# Altium schematic sheet CP2102_USB_UART.SchDoc
size A; SheetNumber: 2; SheetTotal: 7
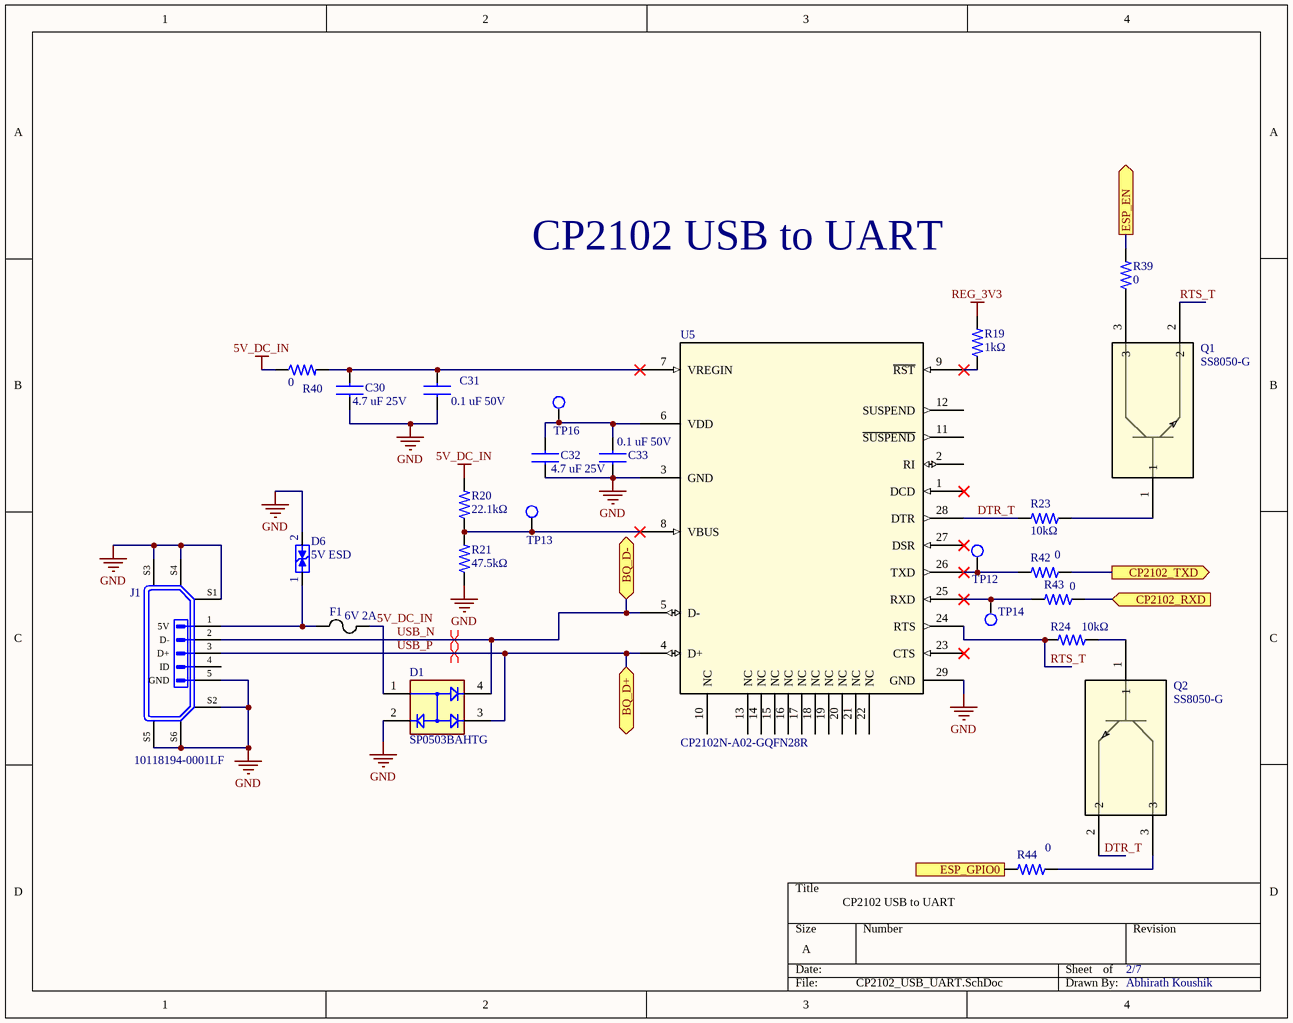
[diagram p0: CP2102_USB_UART.SchDoc]

## Parts
C30  4.7 uF 25V  [CAPC1608X90N]
C31  0.1 uF 50V  [CAPC1608X90N]
C32  4.7 uF 25V  [CAPC1608X90N]
C33  0.1 uF 50V  [CAPC1608X90N]
D1  SP0503BAHTG  [SOT143_New]
D6  5V ESD  [WE-TVS_DFN1610-2L]
F1  6V 2A  [0ZCJ_BEL]
J1  Manufacturer Part Number: 10118194-0001LF  [AMPHENOL_10118194-0001LF]  (hidden comment: micro-USB)
Q1  SS8050-G  [TRAN_SS8050-G_CIP]
Q2  SS8050-G  [TRAN_SS8050-G_CIP]
R19  1kΩ  [RES_0603_1608X06]
R20  22.1kΩ  [RES_0603_1608X06]
R21  47.5kΩ  [RES_0603_1608X06]
R23  10kΩ  [RES_0603_1608X06]
R24  10kΩ  [RES_0603_1608X06]
R39  0  [RES_0603_1608X06]
R40  0  [RES_0603_1608X06]
R42  0  [RES_0603_1608X06]
R43  0  [RES_0603_1608X06]
R44  0  [RES_0603_1608X06]
TP12  Test Point  [Test Point]  (value not drawn)  (net tie, no BOM)
TP13  Test Point  [Test Point]  (value not drawn)  (net tie, no BOM)
TP14  Test Point  [Test Point]  (value not drawn)  (net tie, no BOM)
TP16  Test Point  [Test Point]  (value not drawn)  (net tie, no BOM)
U5  CP2102N-A02-GQFN28R  [IC_CP2102N-A02-GQFN28R]

## Ports
BQ_D+ (bidir, see BQ25798_PMIC[1B]), BQ_D- (bidir, see BQ25798_PMIC[1B]), CP2102_RXD (in, see ESP32_SoC[2B]), CP2102_TXD (out, see ESP32_SoC[2B]), ESP_EN (out, see ESP32_SoC[2A]), ESP_GPIO0 (out, see ESP32_SoC[3A])

## Nets
5V_DC_IN: D1.1 F1.1 R20.2 R40.1
GND: C30.2 C31.2 C32.2 C33.2 D1.2 D6.2(GND) J1.5(GND) J1.S1(GND) J1.S2(GND) J1.S3(GND) J1.S4(GND) J1.S5(GND) J1.S6(GND) R21.1 U5.3(GND) U5.29(GND)
REG_3V3: R19.2
CP2102_RXD: R43.1 ; port CP2102_RXD
CP2102_TXD: R42.1 ; port CP2102_TXD
DTR_T: Q2.2 R23.2 U5.28(DTR)
ESP_EN: R39.2 ; port ESP_EN
ESP_GPIO0: R44.2 ; port ESP_GPIO0
RTS_T: Q1.2 R24.2 U5.24(RTS)
USB_N: D1.4 J1.2(D-) U5.5(D-) ; port BQ_D-
USB_P: D1.3 J1.3(D+) U5.4(D+) ; port BQ_D+
NetC30_1: C30.1 C31.1 R40.2 U5.7(VREGIN)
NetC32_1: C32.1 C33.1 TP16.1 U5.6(VDD)
NetD6_1: D6.1(I/O) F1.2 J1.1(5V)
NetQ1_1: Q1.1 R23.1
NetQ1_3: Q1.3 R39.1
NetQ2_1: Q2.1 R24.1
NetQ2_3: Q2.3 R44.1
NetR19_1: R19.1 U5.9(~{RST})
NetR20_1: R20.1 R21.2 TP13.1 U5.8(VBUS)
NetR42_2: R42.2 TP12.1 U5.26(TXD)
NetR43_2: R43.2 TP14.1 U5.25(RXD)

Not connected (* = marked no-connect by the designer): J1 4(ID); U5 1(DCD)* 2(RI) 10(NC) 11(~{SUSPEND}) 12(SUSPEND) 13(NC) 14(NC) 15(NC) 16(NC) 17(NC) 18(NC) 19(NC) 20(NC) 21(NC) 22(NC) 23(CTS)* 27(DSR)*

## Layout directives
differential pair: USB_N, USB_P

## Notes on the sheet
- CP2102 USB to UART
- 2/7
- Abhirath Koushik

## Library data of the parts
C30 C32 = GRM188R61E475KE11D: Ceramic capacitor SMD 0603 4.7 µF 25 V 10 % (L x W x H) 1.6 x 0.8 x 0.8 mm Murata GRM188R61E475KE11D 4000 pc(s); MF: Murata Electronics; SnapEDA_Link: https://www.snapeda.com/parts/GRM188R61E475KE11D/Murata+Electronics+North+America/view-part/?ref=snap; Package: 1608 Murata; Value: *; MP: GRM188R61E475KE11D; Check_prices: https://www.snapeda.com/parts/GRM188R61E475KE11D/Murata+Electronics+North+America/view-part/?ref=eda
C31 C33 = GCM31C5C1H104FA16L: 0.10uF Tol.1%. Rated voltage 50Vdc 125C SMD capacitor C0G(EIA) with capacitance; MF: Murata; Check_prices: https://www.snapeda.com/parts/GCM31C5C1H104FA16L/Murata/view-part/?ref=eda; Value: *; MP: GCM31C5C1H104FA16L; Purchase-URL: https://pricing.snapeda.com/search/part/GCM31C5C1H104FA16L/?ref=eda; SnapEDA_Link: https://www.snapeda.com/parts/GCM31C5C1H104FA16L/Murata/view-part/?ref=snap; Package: 3216 Murata; Digi-Key_Part_Number: 490-GCM31C5C1H104FA16LTR-ND
D1 = SP0503BAHTG: SP050xBA Series 8.5 V 30 pF Triple Uni-Directional TVS Avalanche Diode-SOT143-4; Manufacturer: Littelfuse; Breakdown Voltage: 5.5V; Value: 30pF; Clamping Voltage: 6.8V; Direction: Unidirectional; Element Configuration: Common Anode; ESD Protection: Yes; Leakage Current: 100nA; Max Power Dissipation: 225mW; Number of Channels: 3; Power Line Protection: No; Voltage Rating (DC): 5V; Supplier: DigiKey; Supplier Part Number: F2715CT-ND; Manufacturer Part Number: SP0503BAHTG; RoHS: Compliant; Category: TVS Diodes; Stock: 99308; Pricing: 1=0.6, 10=0.5, 100=0.424, 500=0.373, 1000=0.343 (USD); Case/Package: SOT-143; China RoHS: Compliant; Composition: Zener; Depth: 1.4mm; Diode Type: Avalanche; Height: 1.22mm; Lead Free: Lead Free; Length: 3.04mm; Lifecycle Status: Production; Max Operating Temperature: 125°C; Max Reverse Leakage Current: 100nA; Min Operating Temperature: -40°C; Mounting Technology: Surface Mount; Number of Elements: 3; Pins: 4; Number of Terminals: 4; Number of Unidirectional Channels: 3; Operating Supply Voltage: 5.5V; Peak Pulse Power: 225mW; Polarity: Unidirectional; Power Dissipation: 225mW; Radiation Hardening: No; REACH SVHC: Yes; Reverse Standoff Voltage: 5.5V; Schedule B: 8536300000, 8536300000|8536300000|8536300000|8536300000|8536300000; Termination: SMD/SMT; Width: 1.4mm; Working Voltage: 5.5V; ComponentLink1URL: https://datasheet.octopart.com:443/SP0503BAHTG-Littelfuse-datasheet-180609594.pdf?src-supplier=Newark; ComponentLink1Description: https://datasheet.octopart.com:443/SP0503BAHTG-Littelfuse-datasheet-180609594.pdf?src-supplier=Newark; ComponentLink2URL: https://datasheet.octopart.com:443/SP0503BAHTG-Littelfuse-datasheet-65933529.pdf?src-supplier=element14+APAC; ComponentLink2Description: https://datasheet.octopart.com:443/SP0503BAHTG-Littelfuse-datasheet-65933529.pdf?src-supplier=element14+APAC; ComponentLink3URL: https://datasheet.octopart.com:443/SP0503BAHTG-Littelfuse-datasheet-8328482.pdf?src-supplier=element14+APAC; ComponentLink3Description: https://datasheet.octopart.com:443/SP0503BAHTG-Littelfuse-datasheet-8328482.pdf?src-supplier=element14+APAC; ComponentLink4URL: https://datasheet.octopart.com:443/SP0503BAHTG-Littelfuse-datasheet-8817999.pdf?src-supplier=element14+APAC; ComponentLink4Description: https://datasheet.octopart.com:443/SP0503BAHTG-Littelfuse-datasheet-8817999.pdf?src-supplier=element14+APAC; ComponentLink5URL: https://datasheet.octopart.com:443/SP0503BAHTG-Littelfuse-datasheet-165517320.pdf?src-supplier=element14+APAC; ComponentLink5Description: https://datasheet.octopart.com:443/SP0503BAHTG-Littelfuse-datasheet-165517320.pdf?src-supplier=element14+APAC; ComponentLink6URL: https://datasheet.octopart.com:443/SP0503BAHTG-Littelfuse-datasheet-137315643.pdf?src-supplier=JRH+Electronics; ComponentLink6Description: https://datasheet.octopart.com:443/SP0503BAHTG-Littelfuse-datasheet-137315643.pdf?src-supplier=JRH+Electronics; ComponentLink7URL: https://datasheet.octopart.com:443/SP0503BAHTG-Littelfuse-datasheet-32996.pdf?src-supplier=Farnell; ComponentLink7Description: https://datasheet.octopart.com:443/SP0503BAHTG-Littelfuse-datasheet-32996.pdf?src-supplier=Farnell; ComponentLink8URL: https://datasheet.octopart.com:443/SP0503BAHTG-Littelfuse-datasheet-622385.pdf?src-supplier=RS+(Formerly+Allied+Electronics); ComponentLink8Description: https://datasheet.octopart.com:443/SP0503BAHTG-Littelfuse-datasheet-622385.pdf?src-supplier=RS+(Formerly+Allied+Electronics); ComponentLink9URL: https://datasheet.octopart.com:443/SP0503BAHTG-Littelfuse-datasheet-125842.pdf?src-supplier=TME; ComponentLink9Description: https://datasheet.octopart.com:443/SP0503BAHTG-Littelfuse-datasheet-125842.pdf?src-supplier=TME; ComponentLink10URL: https://datasheet.octopart.com:443/SP0503BAHTG-Littelfuse-datasheet-165573816.pdf?src-supplier=TME; ComponentLink10Description: https://datasheet.octopart.com:443/SP0503BAHTG-Littelfuse-datasheet-165573816.pdf?src-supplier=TME; ComponentLink11URL: https://datasheet.octopart.com:443/SP0503BAHTG-Littelfuse-datasheet-14049100.pdf?src-supplier=iiiC; ComponentLink11Description: https://datasheet.octopart.com:443/SP0503BAHTG-Littelfuse-datasheet-14049100.pdf?src-supplier=iiiC
D6 = WE-TVS_DFN1610-2L_824032815: MF: {'manufacturer': u'W\xfcrth Elektronik'}; Package: None; Price: None; Value: *; MP: 824032815; Availability: Unavailable
F1 = 0ZCJ0200FF2C: No Description Available; Manufacturer_Name: Belfuse; Copyright: Copyright (C) 2025 Ultra Librarian. All rights reserved.; Manufacturer_Part_Number: 0ZCJ0200FF2C
J1 = USB-Micro B: 10118194-0001LF micro-USB paste-in-pad; Manufacturer: FCI; Number of Contacts: 5; Gender: Receptacle; Specifications: USB 2.0; Current Rating: 1.8 A; Mounting Angle: Right; Insulation Resistance: 1000 MOhms; .Creator: Kailey Shara; .SCHchecked: KS; Supplier 1: Digi-Key; RoHS: RoHS Compliant; Category: Connectors, Interconnects; Stock 1: 27978; Pricing 1: 1=0.46, 10=0.433, 25=0.3712, 50=0.3156, 100=0.3032, 250=0.27224, 500=0.25988 (USD); Packaging: Cut Tape (CT); Connector Type: USB - micro B; Mounting Type: Surface Mount, Right Angle, Horizontal; Features: Shielded, Solder Retention; Ingress Protection: -; ComponentLink1URL: http://portal.fciconnect.com/Comergent//fci/drawing/10118194.pdf; ComponentLink1Description: http://portal.fciconnect.com/Comergent//fci/drawing/10118194.pdf; Color: Black; Contact Plating: Gold; Operating Temperature Range: - 55 C to + 85 C; Product: Micro USB Type B Connectors; Termination Style: SMD; Brand: FCI; Contact Material: Copper Alloy; Flammability Rating: UL 94 V-0; Standard: USB 2.0; Standard Pack Qty: 1200; Minimum Order Quantity: 1; Reeling: True; Supplier Part Number 1: 609-4618-1-ND; .PCBchecked: KS
Q1 Q2 = SS8050-G: Description; Manufacturer_Name: Comchip; Copyright: Copyright (C) 2025 Ultra Librarian. All rights reserved.; Manufacturer_Part_Number: SS8050-G; RefDes: RefDes; Type: Type
R19 = RMCF0603FT1K00: Res Thick Film 0603 1K Ohm 1% 0.1W(1/10W) ±100ppm/C Pad SMD T/R Automotive AEC-Q200; Manufacturer: Stackpole Electronics; Max Power Dissipation: 100mW; Temperature Coefficient: 100ppm/°C; Voltage Rating: 75V; Supplier: DigiKey; Supplier Part Number: RMCF0603FT1K00CT-ND; Manufacturer Part Number: RMCF0603FT1K00; RoHS: Compliant; Category: Chip SMD Resistors; Stock: 3487878; Pricing: 1=0.1, 10=0.013, 25=0.0096, 50=0.0092, 100=0.0069, 250=0.00576, 500=0.0048, 5000=0.0021, 10000=0.00199, 15000=0.00198 (USD); Case/Package: 0603; Case Code (Imperial): 0603; Case Code (Metric): 1608; China RoHS: Non-Compliant; Composition: Thick Film; Contact Plating: Tin; Depth: 800µm; Features: Automotive AEC-Q200; Height: 450µm; Lead Free: Lead Free; Length: 1.55mm; Lifecycle Status: Production; Max Operating Temperature: 155°C; Military Standard: Not; Min Operating Temperature: -55°C; Mounting Technology: Surface Mount; Number of Terminals: 2; Number of Terminations: 2; Packaging: Cut Tape (CT); Power Dissipation: 100mW; Power Rating: 100mW; Radiation Hardening: No; REACH SVHC: Yes; Value: 1kΩ; Schedule B: 8533210045, 8533210045|8533210045, 8533210045|8533210045|8533210045, 8533210045|8533210045|8533210045|8533210045; Tolerance: 1%; Width: 800µm; Working Voltage: 75V; ComponentLink1URL: https://datasheet.octopart.com:443/RMCF0603FT1K00-Stackpole-Electronics-datasheet-182148065.pdf?src-supplier=IHS; ComponentLink1Description: https://datasheet.octopart.com:443/RMCF0603FT1K00-Stackpole-Electronics-datasheet-182148065.pdf?src-supplier=IHS; ComponentLink2URL: https://datasheet.octopart.com:443/RMCF0603FT1K00-Stackpole-Electronics-datasheet-28504820.pdf?src-supplier=Upverter; ComponentLink2Description: https://datasheet.octopart.com:443/RMCF0603FT1K00-Stackpole-Electronics-datasheet-28504820.pdf?src-supplier=Upverter; ComponentLink3URL: https://datasheet.octopart.com:443/RMCF0603FT1K00-Stackpole-Electronics-datasheet-141193804.pdf?src-supplier=Stackpole+Electronics; ComponentLink3Description: https://datasheet.octopart.com:443/RMCF0603FT1K00-Stackpole-Electronics-datasheet-141193804.pdf?src-supplier=Stackpole+Electronics; ComponentLink4URL: https://datasheet.octopart.com:443/RMCF0603FT1K00-Stackpole-Electronics-datasheet-62091608.pdf?src-supplier=Stackpole+Electronics; ComponentLink4Description: https://datasheet.octopart.com:443/RMCF0603FT1K00-Stackpole-Electronics-datasheet-62091608.pdf?src-supplier=Stackpole+Electronics; ComponentLink5URL: https://datasheet.octopart.com:443/RMCF0603FT1K00-Stackpole-Electronics-datasheet-12534581.pdf?src-supplier=Stackpole+Electronics; ComponentLink5Description: https://datasheet.octopart.com:443/RMCF0603FT1K00-Stackpole-Electronics-datasheet-12534581.pdf?src-supplier=Stackpole+Electronics; ComponentLink6URL: https://datasheet.octopart.com:443/RMCF0603FT1K00-Stackpole-Electronics-datasheet-10788263.pdf?src-supplier=Stackpole+Electronics; ComponentLink6Description: https://datasheet.octopart.com:443/RMCF0603FT1K00-Stackpole-Electronics-datasheet-10788263.pdf?src-supplier=Stackpole+Electronics; ComponentLink7URL: https://datasheet.octopart.com:443/RMCF0603FT1K00-Stackpole-Electronics-datasheet-155966809.pdf?src-supplier=Electro+Sonic; ComponentLink7Description: https://datasheet.octopart.com:443/RMCF0603FT1K00-Stackpole-Electronics-datasheet-155966809.pdf?src-supplier=Electro+Sonic; ComponentLink8URL: https://datasheet.octopart.com:443/RMCF0603FT1K00-Stackpole-Electronics-datasheet-189104164.pdf?src-supplier=Master+Electronics; ComponentLink8Description: https://datasheet.octopart.com:443/RMCF0603FT1K00-Stackpole-Electronics-datasheet-189104164.pdf?src-supplier=Master+Electronics; ComponentLink9URL: https://datasheet.octopart.com:443/RMCF0603FT1K00-Stackpole-Electronics-datasheet-11546843.pdf?src-supplier=Arrow+Electronics; ComponentLink9Description: https://datasheet.octopart.com:443/RMCF0603FT1K00-Stackpole-Electronics-datasheet-11546843.pdf?src-supplier=Arrow+Electronics; ComponentLink10URL: https://datasheet.octopart.com:443/RMCF0603FT1K00-Stackpole-Electronics-datasheet-11547379.pdf?src-supplier=Future+Electronics; ComponentLink10Description: https://datasheet.octopart.com:443/RMCF0603FT1K00-Stackpole-Electronics-datasheet-11547379.pdf?src-supplier=Future+Electronics; ComponentLink11URL: https://datasheet.octopart.com:443/RMCF0603FT1K00-Stackpole-Electronics-datasheet-8359789.pdf?src-supplier=Future+Electronics; ComponentLink11Description: https://datasheet.octopart.com:443/RMCF0603FT1K00-Stackpole-Electronics-datasheet-8359789.pdf?src-supplier=Future+Electronics; ComponentLink12URL: https://datasheet.octopart.com:443/RMCF0603FT1K00-Stackpole-Electronics-datasheet-8324226.pdf?src-supplier=Future+Electronics; ComponentLink12Description: https://datasheet.octopart.com:443/RMCF0603FT1K00-Stackpole-Electronics-datasheet-8324226.pdf?src-supplier=Future+Electronics; ComponentLink13URL: http://sigma.octopart.com:80/15940719/materials_sheet/Stackpole-Electronics-RMCF0603FT1K00.pdf?src-supplier=Compliance+Statements; ComponentLink13Description: http://sigma.octopart.com:80/15940719/materials_sheet/Stackpole-Electronics-RMCF0603FT1K00.pdf?src-supplier=Compliance+Statements; ComponentLink14URL: http://sigma.octopart.com:80/141158211/reach_statement/Stackpole-Electronics-RMCF0603FT1K00.pdf?src-supplier=Compliance+Statements; ComponentLink14Description: http://sigma.octopart.com:80/141158211/reach_statement/Stackpole-Electronics-RMCF0603FT1K00.pdf?src-supplier=Compliance+Statements; ComponentLink15URL: http://sigma.octopart.com:80/141158212/rohs_statement/Stackpole-Electronics-RMCF0603FT1K00.pdf?src-supplier=Compliance+Statements; ComponentLink15Description: http://sigma.octopart.com:80/141158212/rohs_statement/Stackpole-Electronics-RMCF0603FT1K00.pdf?src-supplier=Compliance+Statements
R20 = RMCF0603FT22K1: Res Thick Film 0603 22.1K Ohm 1% 0.1W(1/10W) ±100ppm/C Pad SMD Automotive T/R; Manufacturer: Stackpole Electronics; Max Power Dissipation: 100mW; Temperature Coefficient: 100ppm/°C; Voltage Rating: 75V; Supplier: DigiKey; Supplier Part Number: RMCF0603FT22K1CT-ND; Manufacturer Part Number: RMCF0603FT22K1; RoHS: Compliant; Category: Chip SMD Resistors; Stock: 353124; Pricing: 1=0.1, 10=0.013, 25=0.0096, 50=0.0092, 100=0.0069, 250=0.00576, 500=0.0048 (USD); Case/Package: 0603; Case Code (Imperial): 0603; Case Code (Metric): 1608; China RoHS: Non-Compliant; Composition: Thick Film; Contact Plating: Tin; Depth: 800µm; Features: Automotive AEC-Q200; Height: 450µm; Lead Free: Lead Free; Length: 1.5494mm; Lifecycle Status: Production; Max Operating Temperature: 155°C; Military Standard: Not; Min Operating Temperature: -55°C; Mounting Technology: Surface Mount; Number of Terminals: 2; Number of Terminations: 2; Packaging: Cut Tape (CT); Power Dissipation: 100mW; Power Rating: 100mW; Radiation Hardening: No; REACH SVHC: Yes; Value: 22.1kΩ; Schedule B: 8533210045, 8533210045|8533210045, 8533210045|8533210045|8533210045, 8533210045|8533210045|8533210045|8533210045; Tolerance: 1%; Width: 800µm; Working Voltage: 75V; ComponentLink1URL: https://datasheet.octopart.com:443/RMCF0603FT22K1-Stackpole-Electronics-datasheet-182148065.pdf?src-supplier=IHS; ComponentLink1Description: https://datasheet.octopart.com:443/RMCF0603FT22K1-Stackpole-Electronics-datasheet-182148065.pdf?src-supplier=IHS; ComponentLink2URL: https://datasheet.octopart.com:443/RMCF0603FT22K1-Stackpole-Electronics-datasheet-28504820.pdf?src-supplier=Upverter; ComponentLink2Description: https://datasheet.octopart.com:443/RMCF0603FT22K1-Stackpole-Electronics-datasheet-28504820.pdf?src-supplier=Upverter; ComponentLink3URL: https://datasheet.octopart.com:443/RMCF0603FT22K1-Stackpole-Electronics-datasheet-141193804.pdf?src-supplier=Master+Electronics; ComponentLink3Description: https://datasheet.octopart.com:443/RMCF0603FT22K1-Stackpole-Electronics-datasheet-141193804.pdf?src-supplier=Master+Electronics; ComponentLink4URL: https://datasheet.octopart.com:443/RMCF0603FT22K1-Stackpole-Electronics-datasheet-189104163.pdf?src-supplier=Master+Electronics; ComponentLink4Description: https://datasheet.octopart.com:443/RMCF0603FT22K1-Stackpole-Electronics-datasheet-189104163.pdf?src-supplier=Master+Electronics; ComponentLink5URL: https://datasheet.octopart.com:443/RMCF0603FT22K1-Stackpole-Electronics-datasheet-116606903.pdf?src-supplier=Master+Electronics; ComponentLink5Description: https://datasheet.octopart.com:443/RMCF0603FT22K1-Stackpole-Electronics-datasheet-116606903.pdf?src-supplier=Master+Electronics; ComponentLink6URL: https://datasheet.octopart.com:443/RMCF0603FT22K1-Stackpole-Electronics-datasheet-62091608.pdf?src-supplier=Stackpole+Electronics; ComponentLink6Description: https://datasheet.octopart.com:443/RMCF0603FT22K1-Stackpole-Electronics-datasheet-62091608.pdf?src-supplier=Stackpole+Electronics; ComponentLink7URL: https://datasheet.octopart.com:443/RMCF0603FT22K1-Stackpole-Electronics-datasheet-12534581.pdf?src-supplier=Stackpole+Electronics; ComponentLink7Description: https://datasheet.octopart.com:443/RMCF0603FT22K1-Stackpole-Electronics-datasheet-12534581.pdf?src-supplier=Stackpole+Electronics; ComponentLink8URL: https://datasheet.octopart.com:443/RMCF0603FT22K1-Stackpole-Electronics-datasheet-10788263.pdf?src-supplier=Stackpole+Electronics; ComponentLink8Description: https://datasheet.octopart.com:443/RMCF0603FT22K1-Stackpole-Electronics-datasheet-10788263.pdf?src-supplier=Stackpole+Electronics; ComponentLink9URL: https://datasheet.octopart.com:443/RMCF0603FT22K1-Stackpole-Electronics-datasheet-11546843.pdf?src-supplier=Arrow+Electronics; ComponentLink9Description: https://datasheet.octopart.com:443/RMCF0603FT22K1-Stackpole-Electronics-datasheet-11546843.pdf?src-supplier=Arrow+Electronics; ComponentLink10URL: https://datasheet.octopart.com:443/RMCF0603FT22K1-Stackpole-Electronics-datasheet-11547379.pdf?src-supplier=Future+Electronics; ComponentLink10Description: https://datasheet.octopart.com:443/RMCF0603FT22K1-Stackpole-Electronics-datasheet-11547379.pdf?src-supplier=Future+Electronics; ComponentLink11URL: https://datasheet.octopart.com:443/RMCF0603FT22K1-Stackpole-Electronics-datasheet-8359789.pdf?src-supplier=Future+Electronics; ComponentLink11Description: https://datasheet.octopart.com:443/RMCF0603FT22K1-Stackpole-Electronics-datasheet-8359789.pdf?src-supplier=Future+Electronics; ComponentLink12URL: https://datasheet.octopart.com:443/RMCF0603FT22K1-Stackpole-Electronics-datasheet-8324226.pdf?src-supplier=Future+Electronics; ComponentLink12Description: https://datasheet.octopart.com:443/RMCF0603FT22K1-Stackpole-Electronics-datasheet-8324226.pdf?src-supplier=Future+Electronics; ComponentLink13URL: https://datasheet.octopart.com:443/RMCF0603FT22K1-Stackpole-Electronics-datasheet-8088878.pdf?src-supplier=Future+Electronics; ComponentLink13Description: https://datasheet.octopart.com:443/RMCF0603FT22K1-Stackpole-Electronics-datasheet-8088878.pdf?src-supplier=Future+Electronics; ComponentLink14URL: https://datasheet.octopart.com:443/RMCF0603FT22K1-Stackpole-Electronics-datasheet-5313682.pdf?src-supplier=Future+Electronics; ComponentLink14Description: https://datasheet.octopart.com:443/RMCF0603FT22K1-Stackpole-Electronics-datasheet-5313682.pdf?src-supplier=Future+Electronics; ComponentLink15URL: http://sigma.octopart.com:80/15940719/materials_sheet/Stackpole-Electronics-RMCF0603FT22K1.pdf?src-supplier=Compliance+Statements; ComponentLink15Description: http://sigma.octopart.com:80/15940719/materials_sheet/Stackpole-Electronics-RMCF0603FT22K1.pdf?src-supplier=Compliance+Statements; ComponentLink16URL: http://sigma.octopart.com:80/141158212/rohs_statement/Stackpole-Electronics-RMCF0603FT22K1.pdf?src-supplier=Compliance+Statements; ComponentLink16Description: http://sigma.octopart.com:80/141158212/rohs_statement/Stackpole-Electronics-RMCF0603FT22K1.pdf?src-supplier=Compliance+Statements; ComponentLink17URL: http://sigma.octopart.com:80/141158211/reach_statement/Stackpole-Electronics-RMCF0603FT22K1.pdf?src-supplier=Compliance+Statements; ComponentLink17Description: http://sigma.octopart.com:80/141158211/reach_statement/Stackpole-Electronics-RMCF0603FT22K1.pdf?src-supplier=Compliance+Statements
R21 = RMCF0603FT47K5: Res Thick Film 0603 47.5K Ohm 1% 0.1W(1/10W) ±100ppm/C Pad SMD T/R Automotive AEC-Q200; Manufacturer: Stackpole Electronics; Max Power Dissipation: 100mW; Temperature Coefficient: 100ppm/°C; Voltage Rating: 75V; Supplier: DigiKey; Supplier Part Number: RMCF0603FT47K5CT-ND; Manufacturer Part Number: RMCF0603FT47K5; RoHS: Compliant; Category: Chip SMD Resistors; Stock: 151840; Pricing: 1=0.1, 10=0.013, 25=0.0096, 50=0.0092, 100=0.0069, 250=0.00576, 500=0.0048 (USD); Case/Package: 0603; Case Code (Imperial): 0603; Case Code (Metric): 1608; China RoHS: Non-Compliant; Composition: Thick Film; Contact Plating: Tin; Depth: 800µm; Features: Automotive AEC-Q200; Height: 450µm; Lead Free: Lead Free; Length: 1.55mm; Lifecycle Status: Production; Max Operating Temperature: 155°C; Military Standard: Not; Min Operating Temperature: -55°C; Mounting Technology: Surface Mount; Number of Terminals: 2; Number of Terminations: 2; Packaging: Cut Tape (CT); Power Dissipation: 100mW; Power Rating: 100mW; Radiation Hardening: No; REACH SVHC: Yes; Value: 47.5kΩ; Schedule B: 8533210045, 8533210045|8533210045, 8533210045|8533210045|8533210045, 8533210045|8533210045|8533210045|8533210045; Tolerance: 1%; Width: 800µm; Working Voltage: 75V; ComponentLink1URL: https://datasheet.octopart.com:443/RMCF0603FT47K5-Stackpole-Electronics-datasheet-182148065.pdf?src-supplier=IHS; ComponentLink1Description: https://datasheet.octopart.com:443/RMCF0603FT47K5-Stackpole-Electronics-datasheet-182148065.pdf?src-supplier=IHS; ComponentLink2URL: https://datasheet.octopart.com:443/RMCF0603FT47K5-Stackpole-Electronics-datasheet-28504820.pdf?src-supplier=Upverter; ComponentLink2Description: https://datasheet.octopart.com:443/RMCF0603FT47K5-Stackpole-Electronics-datasheet-28504820.pdf?src-supplier=Upverter; ComponentLink3URL: https://datasheet.octopart.com:443/RMCF0603FT47K5-Stackpole-Electronics-datasheet-141193804.pdf?src-supplier=Master+Electronics; ComponentLink3Description: https://datasheet.octopart.com:443/RMCF0603FT47K5-Stackpole-Electronics-datasheet-141193804.pdf?src-supplier=Master+Electronics; ComponentLink4URL: https://datasheet.octopart.com:443/RMCF0603FT47K5-Stackpole-Electronics-datasheet-189104163.pdf?src-supplier=Master+Electronics; ComponentLink4Description: https://datasheet.octopart.com:443/RMCF0603FT47K5-Stackpole-Electronics-datasheet-189104163.pdf?src-supplier=Master+Electronics; ComponentLink5URL: https://datasheet.octopart.com:443/RMCF0603FT47K5-Stackpole-Electronics-datasheet-116606903.pdf?src-supplier=Master+Electronics; ComponentLink5Description: https://datasheet.octopart.com:443/RMCF0603FT47K5-Stackpole-Electronics-datasheet-116606903.pdf?src-supplier=Master+Electronics; ComponentLink6URL: https://datasheet.octopart.com:443/RMCF0603FT47K5-Stackpole-Electronics-datasheet-62091608.pdf?src-supplier=Stackpole+Electronics; ComponentLink6Description: https://datasheet.octopart.com:443/RMCF0603FT47K5-Stackpole-Electronics-datasheet-62091608.pdf?src-supplier=Stackpole+Electronics; ComponentLink7URL: https://datasheet.octopart.com:443/RMCF0603FT47K5-Stackpole-Electronics-datasheet-12534581.pdf?src-supplier=Stackpole+Electronics; ComponentLink7Description: https://datasheet.octopart.com:443/RMCF0603FT47K5-Stackpole-Electronics-datasheet-12534581.pdf?src-supplier=Stackpole+Electronics; ComponentLink8URL: https://datasheet.octopart.com:443/RMCF0603FT47K5-Stackpole-Electronics-datasheet-10788263.pdf?src-supplier=Stackpole+Electronics; ComponentLink8Description: https://datasheet.octopart.com:443/RMCF0603FT47K5-Stackpole-Electronics-datasheet-10788263.pdf?src-supplier=Stackpole+Electronics; ComponentLink9URL: https://datasheet.octopart.com:443/RMCF0603FT47K5-Stackpole-Electronics-datasheet-11547379.pdf?src-supplier=Future+Electronics; ComponentLink9Description: https://datasheet.octopart.com:443/RMCF0603FT47K5-Stackpole-Electronics-datasheet-11547379.pdf?src-supplier=Future+Electronics; ComponentLink10URL: https://datasheet.octopart.com:443/RMCF0603FT47K5-Stackpole-Electronics-datasheet-8359789.pdf?src-supplier=Future+Electronics; ComponentLink10Description: https://datasheet.octopart.com:443/RMCF0603FT47K5-Stackpole-Electronics-datasheet-8359789.pdf?src-supplier=Future+Electronics; ComponentLink11URL: https://datasheet.octopart.com:443/RMCF0603FT47K5-Stackpole-Electronics-datasheet-8324226.pdf?src-supplier=Future+Electronics; ComponentLink11Description: https://datasheet.octopart.com:443/RMCF0603FT47K5-Stackpole-Electronics-datasheet-8324226.pdf?src-supplier=Future+Electronics; ComponentLink12URL: http://sigma.octopart.com:80/15940719/materials_sheet/Stackpole-Electronics-RMCF0603FT47K5.pdf?src-supplier=Compliance+Statements; ComponentLink12Description: http://sigma.octopart.com:80/15940719/materials_sheet/Stackpole-Electronics-RMCF0603FT47K5.pdf?src-supplier=Compliance+Statements; ComponentLink13URL: http://sigma.octopart.com:80/141158211/reach_statement/Stackpole-Electronics-RMCF0603FT47K5.pdf?src-supplier=Compliance+Statements; ComponentLink13Description: http://sigma.octopart.com:80/141158211/reach_statement/Stackpole-Electronics-RMCF0603FT47K5.pdf?src-supplier=Compliance+Statements; ComponentLink14URL: http://sigma.octopart.com:80/141158212/rohs_statement/Stackpole-Electronics-RMCF0603FT47K5.pdf?src-supplier=Compliance+Statements; ComponentLink14Description: http://sigma.octopart.com:80/141158212/rohs_statement/Stackpole-Electronics-RMCF0603FT47K5.pdf?src-supplier=Compliance+Statements
R23 R24 = RC0603FR-0710KL: 100mW Thick Film Resistors 75V ±100ppm/℃ ±1% 10kΩ 0603 Chip Resistor - Surface Mount ROHS; Manufacturer: Yageo Group; Temperature Coefficient: 100ppm/°C; Voltage Rating (DC): 50V; Supplier: DigiKey; Supplier Part Number: 311-10.0KHRCT-ND; Manufacturer Part Number: RC0603FR-0710KL; RoHS: Compliant; Category: Chip SMD Resistors; Stock: 15482043; Pricing: 1=0.1, 10=0.009, 25=0.0088, 50=0.0052, 5000=0.00408, 10000=0.00306, 25000=0.00303, 35000=0.00288, 50000=0.00275, 60000=0.00268, 120000=0.00247, 125000=0.00246 (USD); Case/Package: 0603; Case Code (Imperial): 0603; Case Code (Metric): 0603; China RoHS: Non-Compliant; Composition: Thick Film; Depth: 800µm; Height: 450µm; Lead Free: Lead Free; Lead Pitch: 300µm; Length: 1.6mm; Lifecycle Status: Production; Max Operating Temperature: 155°C; Military Standard: Not; Min Operating Temperature: -55°C; Mounting Technology: Surface Mount; Pins: 2; Number of Terminals: 2; Packaging: Tape & Reel; Power Dissipation: 100mW; Power Rating: 100mW; REACH SVHC: Yes; Value: 10kΩ; Schedule B: 8533210045, 8533210045|8533210045|8533210045|8533210045|8533210045|8533210045|8533210045|8533210045|8533210045|8533210045|8533210045|8533210045|8533210045|8533210045|8533210045|8533210045|8533210045|8533210045|8533210045|8533210045|8533210045|8533210045|8533210045|85; Termination: SMD/SMT; Tolerance: 1%; Voltage Rating: 75V; Weight: 2.012816mg; Width: 800µm; Working Voltage: 75V; ComponentLink1URL: https://datasheet.octopart.com:443/RC0603FR-0710KL-Yageo-datasheet-175887523.pdf?src-supplier=IHS; ComponentLink1Description: https://datasheet.octopart.com:443/RC0603FR-0710KL-Yageo-datasheet-175887523.pdf?src-supplier=IHS; ComponentLink2URL: https://datasheet.octopart.com:443/RC0603FR-0710KL-Yageo-datasheet-103092701.pdf?src-supplier=Upverter; ComponentLink2Description: https://datasheet.octopart.com:443/RC0603FR-0710KL-Yageo-datasheet-103092701.pdf?src-supplier=Upverter; ComponentLink3URL: https://datasheet.octopart.com:443/RC0603FR-0710KL-Yageo-datasheet-98239111.pdf?src-supplier=Upverter; ComponentLink3Description: https://datasheet.octopart.com:443/RC0603FR-0710KL-Yageo-datasheet-98239111.pdf?src-supplier=Upverter; ComponentLink4URL: https://datasheet.octopart.com:443/RC0603FR-0710KL-Yageo-datasheet-141265859.pdf?src-supplier=Upverter; ComponentLink4Description: https://datasheet.octopart.com:443/RC0603FR-0710KL-Yageo-datasheet-141265859.pdf?src-supplier=Upverter; ComponentLink5URL: https://sigma.octopart.com:443/138820526/technical_drawing/Yageo-RC0603FR-0710KL.pdf?src-supplier=Upverter; ComponentLink5Description: https://sigma.octopart.com:443/138820526/technical_drawing/Yageo-RC0603FR-0710KL.pdf?src-supplier=Upverter; ComponentLink6URL: https://datasheet.octopart.com:443/RC0603FR-0710KL-Yageo-datasheet-8328172.pdf?src-supplier=Farnell; ComponentLink6Description: https://datasheet.octopart.com:443/RC0603FR-0710KL-Yageo-datasheet-8328172.pdf?src-supplier=Farnell; ComponentLink7URL: https://datasheet.octopart.com:443/RC0603FR-0710KL-Yageo-datasheet-13691069.pdf?src-supplier=Farnell; ComponentLink7Description: https://datasheet.octopart.com:443/RC0603FR-0710KL-Yageo-datasheet-13691069.pdf?src-supplier=Farnell; ComponentLink8URL: https://datasheet.octopart.com:443/RC0603FR-0710KL-Yageo-datasheet-62067350.pdf?src-supplier=element14+APAC; ComponentLink8Description: https://datasheet.octopart.com:443/RC0603FR-0710KL-Yageo-datasheet-62067350.pdf?src-supplier=element14+APAC; ComponentLink9URL: https://datasheet.octopart.com:443/RC0603FR-0710KL-Yageo-datasheet-17842380.pdf?src-supplier=element14+APAC; ComponentLink9Description: https://datasheet.octopart.com:443/RC0603FR-0710KL-Yageo-datasheet-17842380.pdf?src-supplier=element14+APAC; ComponentLink10URL: https://datasheet.octopart.com:443/RC0603FR-0710KL-Yageo-datasheet-15599030.pdf?src-supplier=Future+Electronics; ComponentLink10Description: https://datasheet.octopart.com:443/RC0603FR-0710KL-Yageo-datasheet-15599030.pdf?src-supplier=Future+Electronics; ComponentLink11URL: https://datasheet.octopart.com:443/RC0603FR-0710KL-Yageo-datasheet-164759695.pdf?src-supplier=Future+Electronics; ComponentLink11Description: https://datasheet.octopart.com:443/RC0603FR-0710KL-Yageo-datasheet-164759695.pdf?src-supplier=Future+Electronics; ComponentLink12URL: https://datasheet.octopart.com:443/RC0603FR-0710KL-Yageo-datasheet-127823281.pdf?src-supplier=Future+Electronics; ComponentLink12Description: https://datasheet.octopart.com:443/RC0603FR-0710KL-Yageo-datasheet-127823281.pdf?src-supplier=Future+Electronics; ComponentLink13URL: https://datasheet.octopart.com:443/RC0603FR-0710KL-Yageo-datasheet-137700087.pdf?src-supplier=Future+Electronics; ComponentLink13Description: https://datasheet.octopart.com:443/RC0603FR-0710KL-Yageo-datasheet-137700087.pdf?src-supplier=Future+Electronics; ComponentLink14URL: https://datasheet.octopart.com:443/RC0603FR-0710KL-Yageo-datasheet-27584510.pdf?src-supplier=Future+Electronics; ComponentLink14Description: https://datasheet.octopart.com:443/RC0603FR-0710KL-Yageo-datasheet-27584510.pdf?src-supplier=Future+Electronics; ComponentLink15URL: https://datasheet.octopart.com:443/RC0603FR-0710KL-Yageo-datasheet-8324193.pdf?src-supplier=Future+Electronics; ComponentLink15Description: https://datasheet.octopart.com:443/RC0603FR-0710KL-Yageo-datasheet-8324193.pdf?src-supplier=Future+Electronics; ComponentLink16URL: https://datasheet.octopart.com:443/RC0603FR-0710KL-Yageo-datasheet-12596169.pdf?src-supplier=Newark; ComponentLink16Description: https://datasheet.octopart.com:443/RC0603FR-0710KL-Yageo-datasheet-12596169.pdf?src-supplier=Newark; ComponentLink17URL: https://datasheet.octopart.com:443/RC0603FR-0710KL-Yageo-datasheet-503470.pdf?src-supplier=Newark; ComponentLink17Description: https://datasheet.octopart.com:443/RC0603FR-0710KL-Yageo-datasheet-503470.pdf?src-supplier=Newark; ComponentLink18URL: https://datasheet.octopart.com:443/RC0603FR-0710KL-Yageo-datasheet-34211833.pdf?src-supplier=Newark; ComponentLink18Description: https://datasheet.octopart.com:443/RC0603FR-0710KL-Yageo-datasheet-34211833.pdf?src-supplier=Newark; ComponentLink19URL: https://datasheet.octopart.com:443/RC0603FR-0710KL-Yageo-datasheet-79472498.pdf?src-supplier=Megastar; ComponentLink19Description: https://datasheet.octopart.com:443/RC0603FR-0710KL-Yageo-datasheet-79472498.pdf?src-supplier=Megastar; ComponentLink20URL: https://datasheet.octopart.com/RC0603FR-0710KL-Yageo-datasheet-73766026.pdf; ComponentLink20Description: https://datasheet.octopart.com/RC0603FR-0710KL-Yageo-datasheet-73766026.pdf; ComponentLink21URL: https://datasheet.octopart.com:443/RC0603FR-0710KL-Yageo-datasheet-118562.pdf?src-supplier=DigiKey; ComponentLink21Description: https://datasheet.octopart.com:443/RC0603FR-0710KL-Yageo-datasheet-118562.pdf?src-supplier=DigiKey; ComponentLink22URL: http://sigma.octopart.com:80/rohs_statement/Yageo-company-2.pdf?src-supplier=Compliance+Statements; ComponentLink22Description: http://sigma.octopart.com:80/rohs_statement/Yageo-company-2.pdf?src-supplier=Compliance+Statements; ComponentLink23URL: http://sigma.octopart.com:80/conflict_mineral_statement/Yageo-company-3.pdf?src-supplier=Compliance+Statements; ComponentLink23Description: http://sigma.octopart.com:80/conflict_mineral_statement/Yageo-company-3.pdf?src-supplier=Compliance+Statements
R39 R40 R42-R44 = MCT06030Z0000ZP500: 0 Ohms Jumper 0.125W, 1/8W Chip Resistor 0603 (1608 Metric) Anti-Sulfur Thin Film; MF: Vishay; SnapEDA_Link: https://www.snapeda.com/parts/MCT06030Z0000ZP500/Vishay+Beyschlag/view-part/?ref=snap; Package: 1508 Vishay; Value: *; MP: MCT06030Z0000ZP500; Check_prices: https://www.snapeda.com/parts/MCT06030Z0000ZP500/Vishay+Beyschlag/view-part/?ref=eda
U5 = CP2102N-A02-GQFN28R: Interface IC full speed USB to UART bridge USB 2.0 3.3V, CP2102N-A02-GQFN24R, VFQFN-24; Manufacturer: Silicon Labs; Manufacturer Lifecycle Status: FULL PRODUCTION; Data Rate: 1.5Mbps; Max Junction Temperature (Tj): 105°C; Max Supply Voltage: 3.6V; Min Supply Voltage: 3V; Number of Digital IO: 4; Supplier: DigiKey; Supplier Part Number: 336-5888-1-ND; Manufacturer Part Number: CP2102N-A02-GQFN24R; RoHS: Compliant; Category: Interface ICs; Stock: 10504; Pricing: 1=4.14, 10=3.135, 25=2.8832, 100=2.6064, 250=2.4744, 500=2.39488, 1500=2.29663, 3000=2.24855 (USD); Ambient Temperature Range High: 85°C; China RoHS: Compliant; Height: 800µm; Height - Seated (Max): 800µm; Interface: UART; Length: 4mm; Lifecycle Status: Production; Max Operating Temperature: 85°C; Min Operating Temperature: -40°C; Number of Terminals: 24; Operating Supply Voltage: 3.3V; REACH SVHC: Yes; Schedule B: 8542390000, 8542390000|8542390000|8542390000|8542390000|8542390000; Terminal Pitch: 500µm; Width: 4mm; ComponentLink1URL: https://datasheet.octopart.com:443/CP2102N-A02-GQFN24R-Silicon-Labs-datasheet-138898368.pdf?src-supplier=SHENGYU+ELECTRONICS; ComponentLink1Description: https://datasheet.octopart.com:443/CP2102N-A02-GQFN24R-Silicon-Labs-datasheet-138898368.pdf?src-supplier=SHENGYU+ELECTRONICS; ComponentLink2URL: https://datasheet.octopart.com:443/CP2102N-A02-GQFN24R-Silicon-Labs-datasheet-166051788.pdf?src-supplier=Burklin+Elektronik; ComponentLink2Description: https://datasheet.octopart.com:443/CP2102N-A02-GQFN24R-Silicon-Labs-datasheet-166051788.pdf?src-supplier=Burklin+Elektronik